# EAGLE schematic car_key (EAGLE 9.5.1)

## Sheet 1 of 3: Main
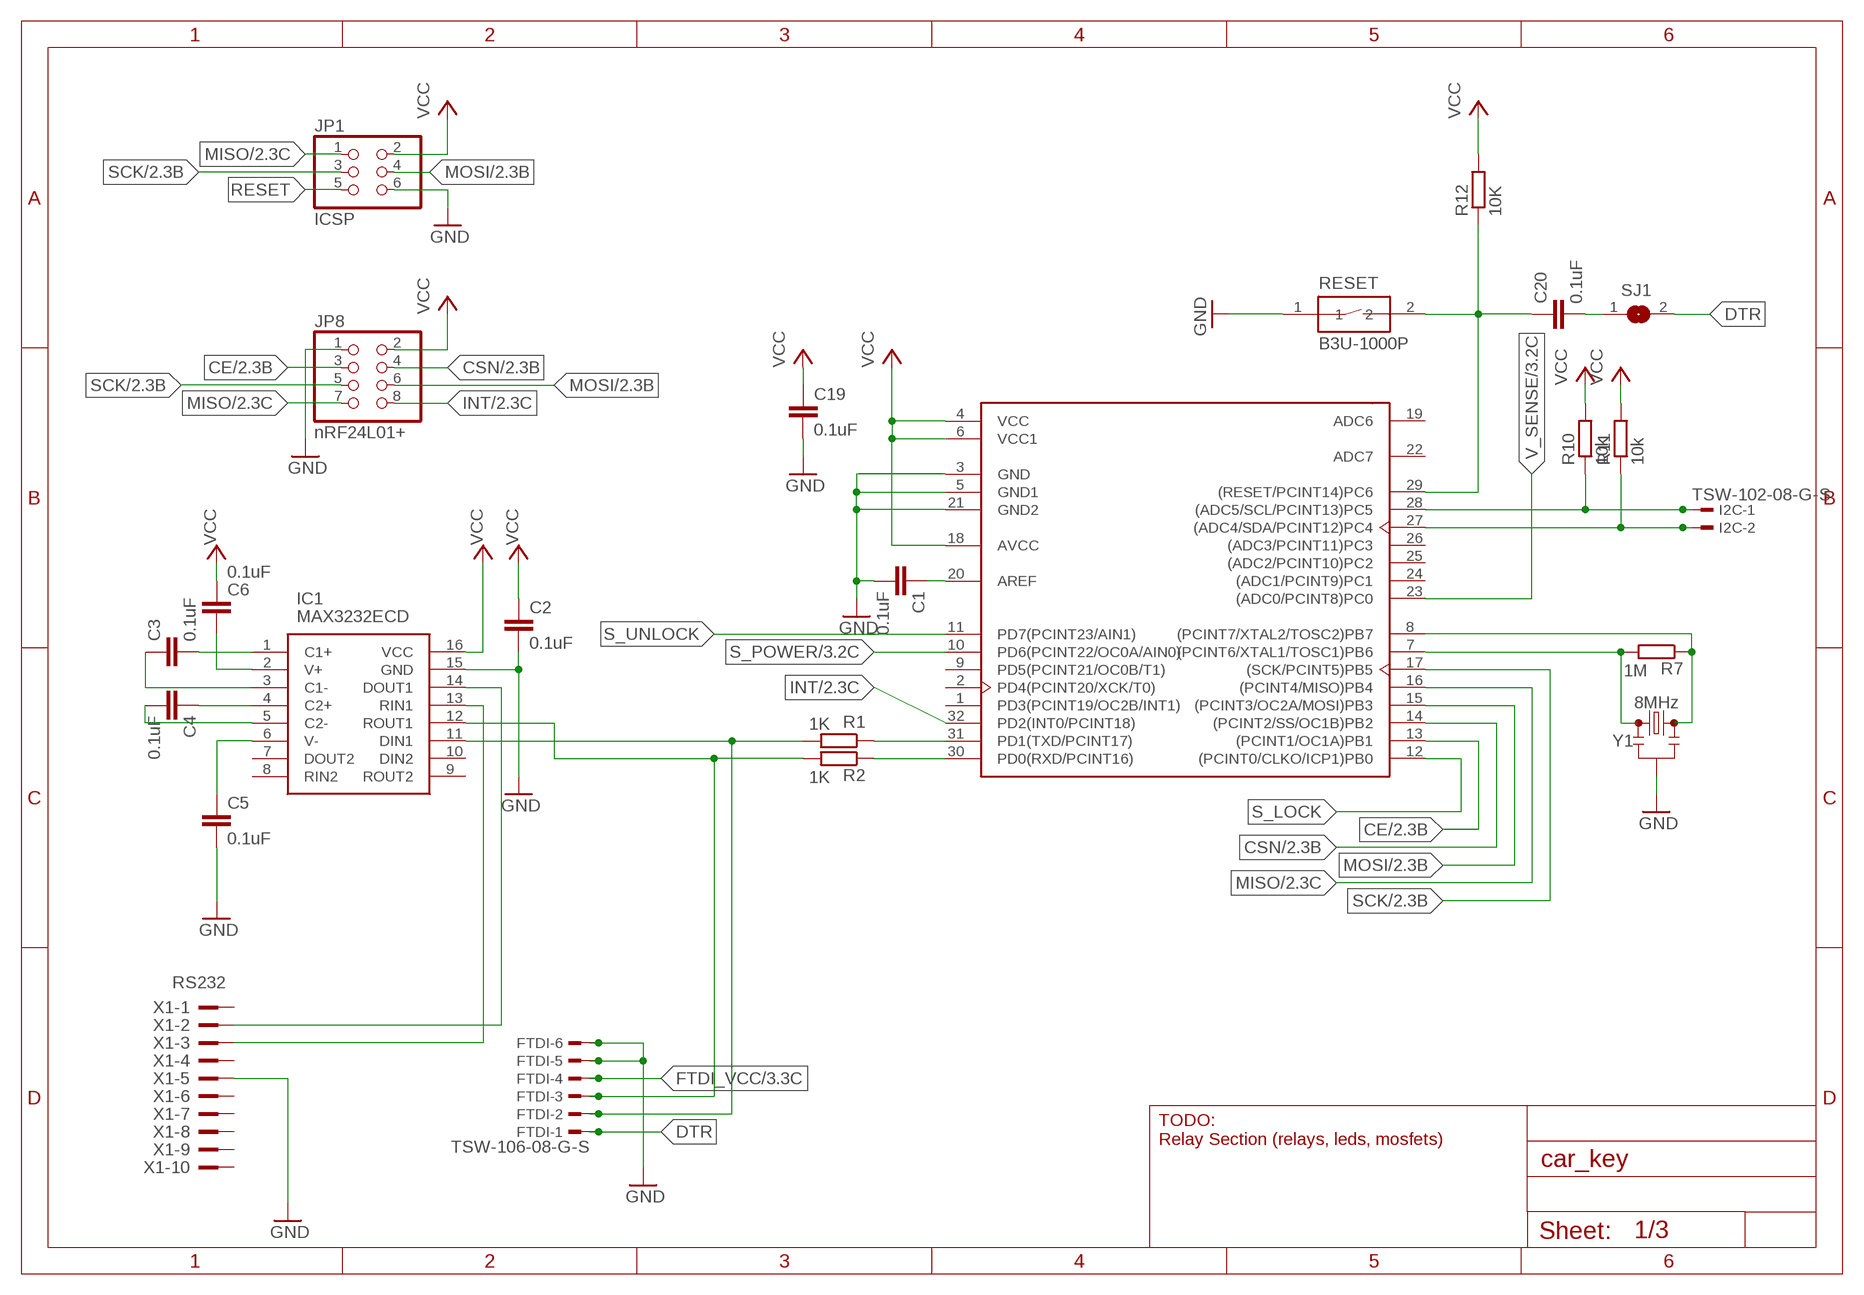
[diagram p0: schematic, sheet 1]

### Parts
C1  0.1uF  C-EUC0805  [C0805]
C2  0.1uF  C-EUC0805  [C0805]
C3  0.1uF  C-EUC0805  [C0805]
C4  0.1uF  C-EUC0805  [C0805]
C5  0.1uF  C-EUC0805  [C0805]
C6  0.1uF  C-EUC0805  [C0805]
C19  0.1uF  C-EUC0805  [C0805]
C20  0.1uF  C-EUC0805  [C0805]
FTDI  TSW-106-08-G-S  [TSW-106-XX-G-S]
I2C  TSW-102-08-G-S  [TSW-102-XX-G-S]
IC1  MAX3232ECD  [SOIC127P600X175-16N]
JP1  ICSP  PINHD-2X3  [2X03]
JP8  nRF24L01+  PINHD-2X4  [2X04]
R1  1K  R-EU_R0805  [R0805]
R2  1K  R-EU_R0805  [R0805]
R7  1M  R-EU_R0805  [R0805]
R10  10k  R-EU_R0805  [R0805]
R11  10k  R-EU_R0805  [R0805]
R12  10K  R-EU_R0805  [R0805]
RESET  B3U-1000P  [B3U-1000P]
SJ1  SJ  [SJ]
U2  ATMEGA328P-AU  [TQFP-32]
X1  RS232  2510-  [PAK100/2500-10]
Y1  8MHz  RESONATOR-8MHZSMD_3.2X1.3  [RESONATOR-SMD-3.2X1.3]

### Nets
CE: JP8.3 U2.13((PCINT1/OC1A)PB1) ; also sheet 2
CSN: JP8.4 U2.14((PCINT2/SS/OC1B)PB2) ; also sheet 2
DTR: FTDI.1 SJ1.2
FTDI_VCC: FTDI.4 ; also sheet 3
GND: C1.2 C2.2 C5.2 C19.2 FTDI.5 FTDI.6 IC1.15(GND) JP1.6 JP8.1 RESET.1 U2.3(GND) U2.5(GND1) U2.21(GND2) X1.5 Y1.2 ; also sheet 2,3
INT: JP8.8 U2.32(PD2(INT0/PCINT18)) ; also sheet 2
MISO: JP1.1 JP8.7 U2.16((PCINT4/MISO)PB4) ; also sheet 2
MOSI: JP1.4 JP8.6 U2.15((PCINT3/OC2A/MOSI)PB3) ; also sheet 2
N$1: C1.1 U2.20(AREF)
N$2: R7.2 U2.7((PCINT6/XTAL1/TOSC1)PB6) Y1.1
N$3: R7.1 U2.8((PCINT7/XTAL2/TOSC2)PB7) Y1.3
N$4: R1.1 U2.31(PD1(TXD/PCINT17))
N$5: R2.1 U2.30(PD0(RXD/PCINT16))
N$6: C5.1 IC1.6(V-)
N$7: C3.2 IC1.1(C1+)
N$8: C4.2 IC1.5(C2-)
N$9: C3.1 IC1.3(C1-)
N$10: C4.1 IC1.4(C2+)
N$11: C6.1 IC1.2(V+)
N$12: IC1.13(RIN1) X1.3
N$13: IC1.14(DOUT1) X1.2
N$28: C20.2 SJ1.1
RESET: C20.1 JP1.5 R12.1 RESET.2 U2.29((RESET/PCINT14)PC6)
RX-I: FTDI.3 IC1.12(ROUT1) R2.2
S_LOCK: U2.12((PCINT0/CLKO/ICP1)PB0)
S_POWER: U2.10(PD6(PCINT22/OC0A/AIN0)) ; also sheet 3
S_UNLOCK: U2.11(PD7(PCINT23/AIN1))
SCK: JP1.3 JP8.5 U2.17((SCK/PCINT5)PB5) ; also sheet 2
SCL: I2C.1 R10.1 U2.28((ADC5/SCL/PCINT13)PC5)
SDA: I2C.2 R11.1 U2.27((ADC4/SDA/PCINT12)PC4)
TX-O: FTDI.2 IC1.11(DIN1) R1.2
V_SENSE: U2.23((ADC0/PCINT8)PC0) ; also sheet 3
VCC: C2.1 C6.2 C19.1 IC1.16(VCC) JP1.2 JP8.2 R10.2 R11.2 R12.2 U2.4(VCC) U2.6(VCC1) U2.18(AVCC) ; also sheet 2,3
Unconnected: IC1.7(DOUT2) IC1.8(RIN2) IC1.9(ROUT2) IC1.10(DIN2) U2.1(PD3(PCINT19/OC2B/INT1)) U2.2(PD4(PCINT20/XCK/T0)) U2.9(PD5(PCINT21/OC0B/T1)) U2.19(ADC6) U2.22(ADC7) U2.24((ADC1/PCINT9)PC1) U2.25((ADC2/PCINT10)PC2) U2.26((ADC3/PCINT11)PC3) X1.1 X1.4 X1.6 X1.7 X1.8 X1.9 X1.10

### Notes on the sheet
- TODO:
  Relay Section (relays, leds, mosfets)

## Sheet 2 of 3: Wireless
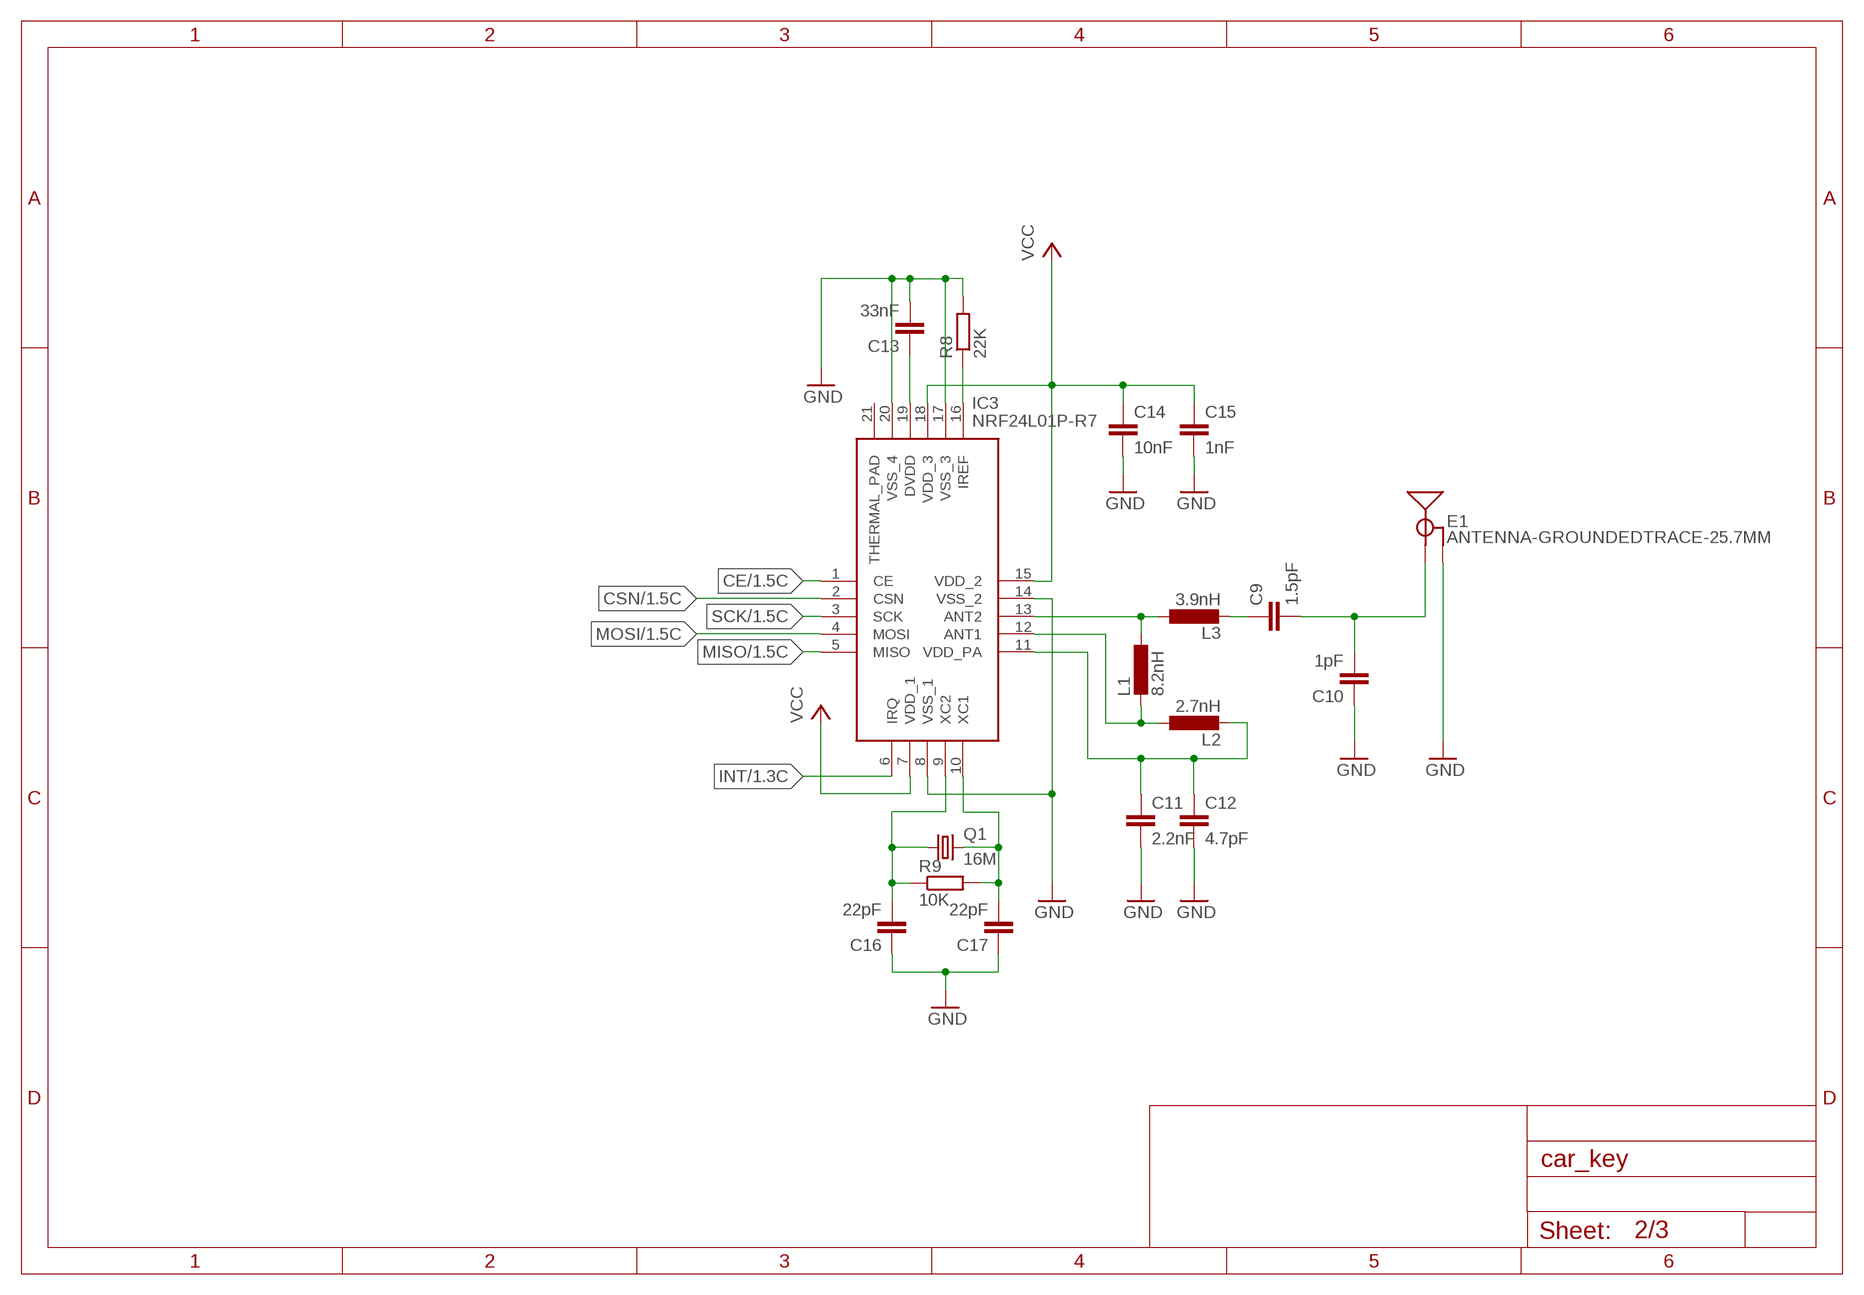
[diagram p1: schematic, sheet 2]

### Parts
C9  1.5pF  C-EUC0805  [C0805]
C10  1pF  C-EUC0805  [C0805]
C11  2.2nF  C-EUC0805  [C0805]
C12  4.7pF  C-EUC0805  [C0805]
C13  33nF  C-EUC0805  [C0805]
C14  10nF  C-EUC0805  [C0805]
C15  1nF  C-EUC0805  [C0805]
C16  22pF  C-EUC0805  [C0805]
C17  22pF  C-EUC0805  [C0805]
E1  ANTENNA-GROUNDEDTRACE-25.7MM  [TRACE_ANTENNA_2.4GHZ_25.7MM]
IC3  NRF24L01P-R7  [QFN50P400X400X95-21N]
L1  8.2nH  L-EUL2012C  [L2012C]
L2  2.7nH  L-EUL2012C  [L2012C]
L3  3.9nH  L-EUL2012C  [L2012C]
Q1  16M  CRYSTALHC49S  [HC49/S]
R8  22K  R-EU_R0805  [R0805]
R9  10K  R-EU_R0805  [R0805]

### Nets
CE: IC3.1(CE) ; also sheet 1
CSN: IC3.2(CSN) ; also sheet 1
GND: C10.1 C11.2 C12.2 C13.2 C14.2 C15.2 C16.1 C17.1 E1.GND E1.GND2(GND) IC3.8(VSS_1) IC3.14(VSS_2) IC3.17(VSS_3) IC3.20(VSS_4) R8.2 ; also sheet 1,3
INT: IC3.6(IRQ) ; also sheet 1
MISO: IC3.5(MISO) ; also sheet 1
MOSI: IC3.4(MOSI) ; also sheet 1
N$14: IC3.13(ANT2) L1.1 L3.1
N$15: IC3.12(ANT1) L1.2 L2.1
N$16: C11.1 C12.1 IC3.11(VDD_PA) L2.2
N$17: C9.1 L3.2
N$18: C9.2 C10.2 E1.ANT(SIGNAL)
N$19: C13.1 IC3.19(DVDD)
N$21: C16.2 IC3.9(XC2) Q1.1 R9.1
N$22: C17.2 IC3.10(XC1) Q1.2 R9.2
N$23: IC3.16(IREF) R8.1
SCK: IC3.3(SCK) ; also sheet 1
VCC: C14.1 C15.1 IC3.7(VDD_1) IC3.15(VDD_2) IC3.18(VDD_3) ; also sheet 1,3
Unconnected: IC3.21(THERMAL_PAD)

## Sheet 3 of 3: Power
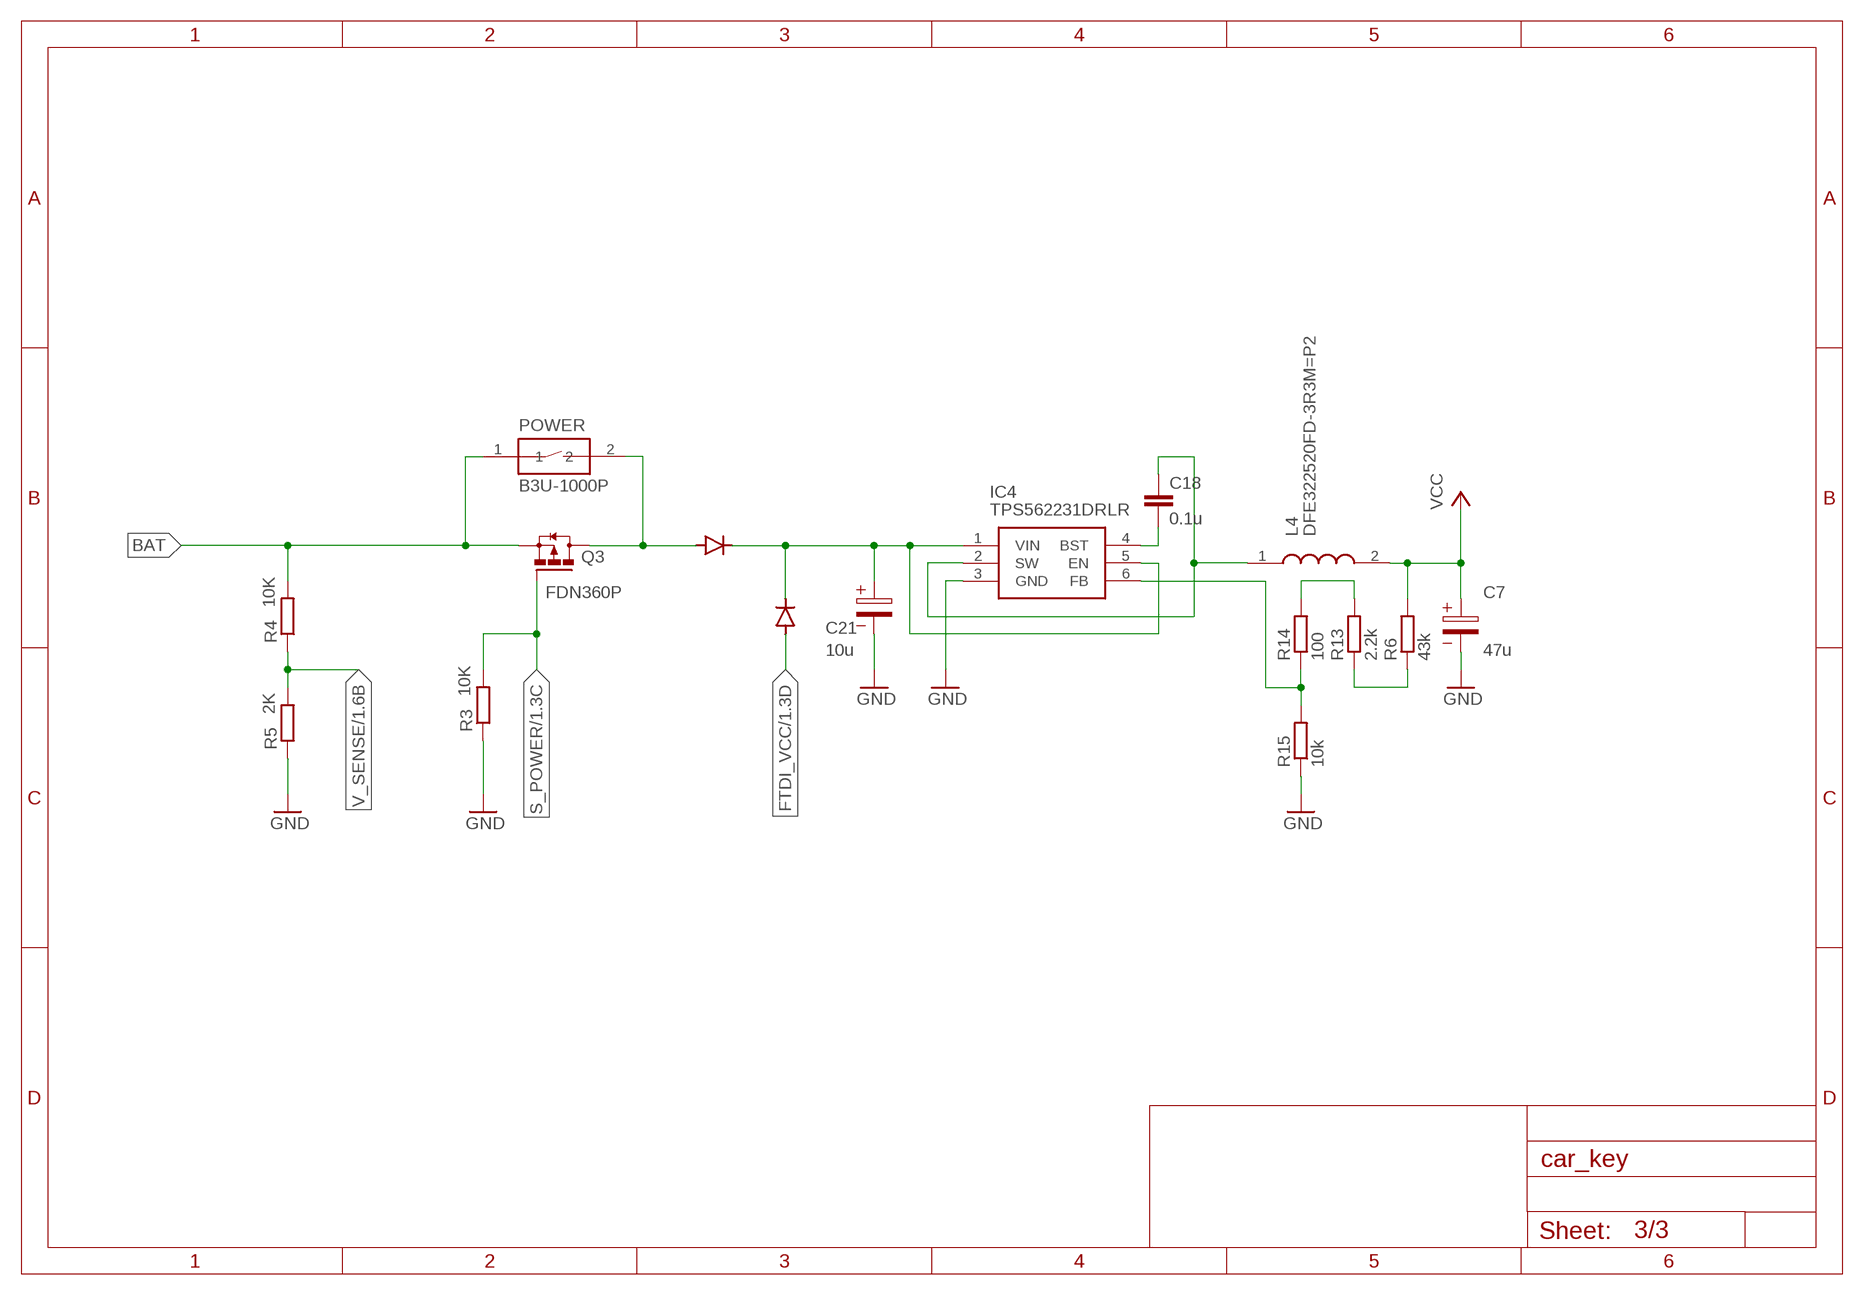
[diagram p2: schematic, sheet 3]

### Parts
C7  47u  WCAP-ASLI_4X5,5_865080140004  [2.6X1.6X1(BXCXA)]
C18  0.1u  C-EUC0805  [C0805]
C21  10u  WCAP-ASLI_4X5,5_865080340001  [2.6X1.6X1(BXCXA)]
D1  DIODE-SOD123  [SOD123]
D2  DIODE-SOD123  [SOD123]
IC4  TPS562231DRLR  [SOTFL50P160X60-6N]
L4  DFE322520FD-3R3M=P2  [INDC3225X200N]
POWER  B3U-1000P  [B3U-1000P]
Q3  FDN360P  [SUPER-SOT3]
R3  10K  R-EU_R0805  [R0805]
R4  10K  R-EU_R0805  [R0805]
R5  2K  R-EU_R0805  [R0805]
R6  43k  R-EU_R0805  [R0805]
R13  2.2k  R-EU_R0805  [R0805]
R14  100  R-EU_R0805  [R0805]
R15  10k  R-EU_R0805  [R0805]

### Nets
BAT: POWER.1 Q3.2(S) R4.2
FTDI_VCC: D1.A ; also sheet 1
GND: C7.2 C21.2 IC4.3(GND) R3.1 R5.1 R15.1 ; also sheet 1,2
N$24: C18.1 IC4.2(SW) L4.1
N$25: C18.2 IC4.4(BST)
N$26: R13.2 R14.2
N$27: C21.1 D1.C D2.C IC4.1(VIN) IC4.5(EN)
N$30: R6.1 R13.1
N$31: IC4.6(FB) R14.1 R15.2
N$33: D2.A POWER.2 Q3.3(D)
S_POWER: Q3.1(G) R3.2 ; also sheet 1
V_SENSE: R4.1 R5.2 ; also sheet 1
VCC: C7.1 L4.2 R6.2 ; also sheet 1,2

## Library data of the parts
C1-C6 C18-C20 = rcl:C-EU: CAPACITOR, European symbol; SPICEPREFIX: C
C7 = Wurth_Elektronik_Passive_Capacitors_rev18b:WCAP-ASLI: WCAP-ASLI Aluminum Electrolytic Capacitors Characteristics Aluminum Electrolytic Capacitor Recommended soldering: Reflow Operating temperature: -55 °C to +105 °C Low impedance product series Load life:2000 h @ +105 °C Package name and Variant abbreviation: Package: Package: B X C X A = length of the solder pad X width of the solder pad X pitch of the solder pad. <http://katalog.we-online.de/media/images/eisos/WCAP-ASLI_pf2.jpg> Details see: http://katalog.we-online.de/en/pbs/WCAP-ASLI Updated by: Yingchun,Shan Updated: 2017-03-16 2017 (C) Wurth Elektronik; WE-NUMBER: 865080140004/47uF
C9-C17 = resistor:C-EU: CAPACITOR, European symbol
C21 = Wurth_Elektronik_Passive_Capacitors_rev18b:WCAP-ASLI: WCAP-ASLI Aluminum Electrolytic Capacitors Characteristics Aluminum Electrolytic Capacitor Recommended soldering: Reflow Operating temperature: -55 °C to +105 °C Low impedance product series Load life:2000 h @ +105 °C Package name and Variant abbreviation: Package: Package: B X C X A = length of the solder pad X width of the solder pad X pitch of the solder pad. <http://katalog.we-online.de/media/images/eisos/WCAP-ASLI_pf2.jpg> Details see: http://katalog.we-online.de/en/pbs/WCAP-ASLI Updated by: Yingchun,Shan Updated: 2017-03-16 2017 (C) Wurth Elektronik; WE-NUMBER: 865080340001/10uF
D1 D2 = diode:DIODE-: DIODE
E1 = SparkFun-RF:ANTENNA-GROUNDED: Antenna w/ Ground Connection 2.4GHz antennae with signal and ground terminals. TRACE_ANTENNA_2.4GHZ_15.2MM - Meander Trace antenna 15.2 x 5.7mm footprint Based on layout from TI app note AN043 <http://www.ti.com/lit/an/swra117d/swra117d.pdf>. TRACE_ANTENNA_2.4GHZ_25.7MM - Inverted F trace antenna 25.7 x 7.5 mm footprint. Based on layout from TI design note DN0007 <http://www.ti.com/lit/an/swru120b/swru120b.pdf>.
FTDI = con-samtec:TSW-106-*-G-S: THROUGH-HOLE .025" SQ POST HEADER Source: Samtec TSW.pdf; MF: Samtec Inc.; MPN: TSW-106-07-G-S
I2C = con-samtec:TSW-102-*-G-S: THROUGH-HOLE .025" SQ POST HEADER Source: Samtec TSW.pdf; MF: Samtec Inc.; MPN: TSW-102-07-G-S
IC1 = MAX3232ECD:MAX3232ECD: Texas Instruments MAX3232ECD, Dual Line Transceiver, EIA/TIA-232-F/ RS-232/ V.28 2-TX 2-RX 2-TRX, 3.3 V, 5 V, 16-Pin Source: Datasheet <http://www.ti.com/lit/gpn/max3232e>; DESCRIPTION: Texas Instruments MAX3232ECD, Dual Line Transceiver, EIA/TIA-232-F/ RS-232/ V.28 2-TX 2-RX 2-TRX, 3.3 V, 5 V, 16-Pin; HEIGHT: 1.75mm; MANUFACTURER_NAME: Texas Instruments; MANUFACTURER_PART_NUMBER: MAX3232ECD; MOUSER_PART_NUMBER: 595-MAX3232ECD; MOUSER_PRICE-STOCK: https://www.mouser.com/Search/Refine.aspx?Keyword=595-MAX3232ECD; RS_PART_NUMBER: 6608704P; RS_PRICE-STOCK: http://uk.rs-online.com/web/p/products/6608704P
IC3 = NRF24L01P-R7:NRF24L01P-R7: NORDIC SEMICONDUCTOR - NRF24L01P-R7 - RF TRANSCEIVER, 2MBPS, 2.525GHZ, QFN-20 Source: Datasheet <https://www.mouser.com/ds/2/297/nRF24L01P-1187709.pdf>; DESCRIPTION: NORDIC SEMICONDUCTOR - NRF24L01P-R7 - RF TRANSCEIVER, 2MBPS, 2.525GHZ, QFN-20; HEIGHT: 0.95mm; MANUFACTURER_NAME: Nordic Semiconductor; MANUFACTURER_PART_NUMBER: NRF24L01P-R7; MOUSER_PART_NUMBER: 949-NRF24L01P-R7; MOUSER_PRICE-STOCK: https://www.mouser.com/Search/Refine.aspx?Keyword=949-NRF24L01P-R7
IC4 = TPS562231DRLR:TPS562231DRLR: 4.5-V to 17-V input, 2-A output, synchronous step-down converter Source: Datasheet <http://www.ti.com/lit/gpn/TPS562231>; DESCRIPTION: 4.5-V to 17-V input, 2-A output, synchronous step-down converter; HEIGHT: 0.6mm; MANUFACTURER_NAME: Texas Instruments; MANUFACTURER_PART_NUMBER: TPS562231DRLR; MOUSER_PART_NUMBER: 595-TPS562231DRLR; MOUSER_PRICE-STOCK: https://www.mouser.com/Search/Refine.aspx?Keyword=595-TPS562231DRLR
JP1 = pinhead:PINHD-2X3: PIN HEADER
JP8 = pinhead:PINHD-2X4: PIN HEADER
L1-L3 = rcl:L-EU: INDUCTOR, European symbol; SPICEPREFIX: L
L4 = DFE322520FD-3R3M=P2:DFE322520FD-3R3M=P2: DFE322520F_D Series Inductor 3.3uH +/-20% 1210 (3225) Source: Datasheet <https://psearch.en.murata.com/inductor/product/DFE322520FD-3R3M#.html>; DESCRIPTION: DFE322520F_D Series Inductor 3.3uH +/-20% 1210 (3225); HEIGHT: 2mm; MANUFACTURER_NAME: Murata Electronics; MANUFACTURER_PART_NUMBER: DFE322520FD-3R3M=P2; MOUSER_PART_NUMBER: 81-DFE322520FD3R3MP2; MOUSER_PRICE-STOCK: https://www.mouser.com/Search/Refine.aspx?Keyword=81-DFE322520FD3R3MP2
POWER RESET = Switch:B3U-1000P: SWITCH TACTILE SPST-NO 0.05A 12V Manufacturer's datasheet <https://omronfs.omron.com/en_US/ecb/products/pdf/en-b3u.pdf>; CREATED_BY: PCBLayout.com; DIGI_KEY_PART_NUMBER: SW1020CT-ND; MANUFACTURER: Omron Electronics Inc-EMC Div; MPN: B3U-1000P; PACKAGE: SPST-NO
Q1 = crystal:CRYSTAL: CRYSTAL; OC_FARNELL: 1667008; OC_NEWARK: unknown
Q3 = transistor-power:FDN360P: Single P-Channel, PowerTrench (R) MOSFET Source: http://www.fairchildsemi.com/ds/FD/FDN360P.pdf
R1-R15 = rcl:R-EU_: RESISTOR, European symbol; SPICEPREFIX: R
SJ1 = jumper:SJ: SMD solder JUMPER
U2 = Microcontroller:ATMEGA328P-AU: IC MCU 8BIT 32KB FLASH 32TQFP Manufacturer's datasheet <http://ww1.microchip.com/downloads/en/DeviceDoc/ATmega48A-PA-88A-PA-168A-PA-328-P-DS-DS40002061A.pdf>; CREATED_BY: PCBLayout.com; DIGIKEY_PART_NUMBER: ATMEGA328P-AU-ND; MANUFACTURER: Microchip Technology; MPN: ATMEGA328P-AU; PACKAGE: TQFP-32
X1 = con-3m:2510-: 3M (TM) Pak 100 4-Wall Header Source: 3M; MF: 3M; MPN: 2510-6002UB; OC_FARNELL: 9838244; OC_NEWARK: 46F4725
Y1 = SparkFun-Clocks:RESONATOR-8MHZ: 8MHz Resonator Digikey Example <http://www.digikey.com/product-detail/en/murata-electronics-north-america/CSTCE10M0G55-R0/490-1196-1-ND/584633> Frequency: 8MHz Frequency Stability: ±0.2% Frequency Tolerance: ±0.5% Capacitance: 33pF SparkFun Products Arduino Pro Mini 328- 3.3V/8MHz <https://www.sparkfun.com/products/11114> SparkFun Digital Sandbox <https://www.sparkfun.com/products/12651>; PROD_ID: XTAL-08895